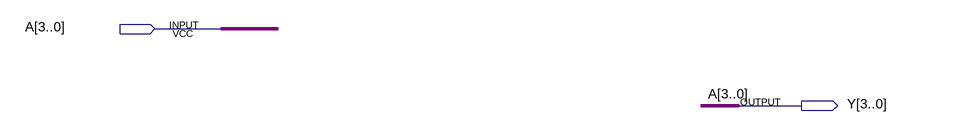
[diagram p0: schematic sheet]
// Quartus schematic Transfer.bdf as structural Verilog: 0 symbols, 2 pins
module Transfer (
  input  [3:0] A,
  output [3:0] Y
);


  assign Y = A;
endmodule
